# EAGLE design MaPIE LoRa Radio v2.1 (EAGLE 6.1)
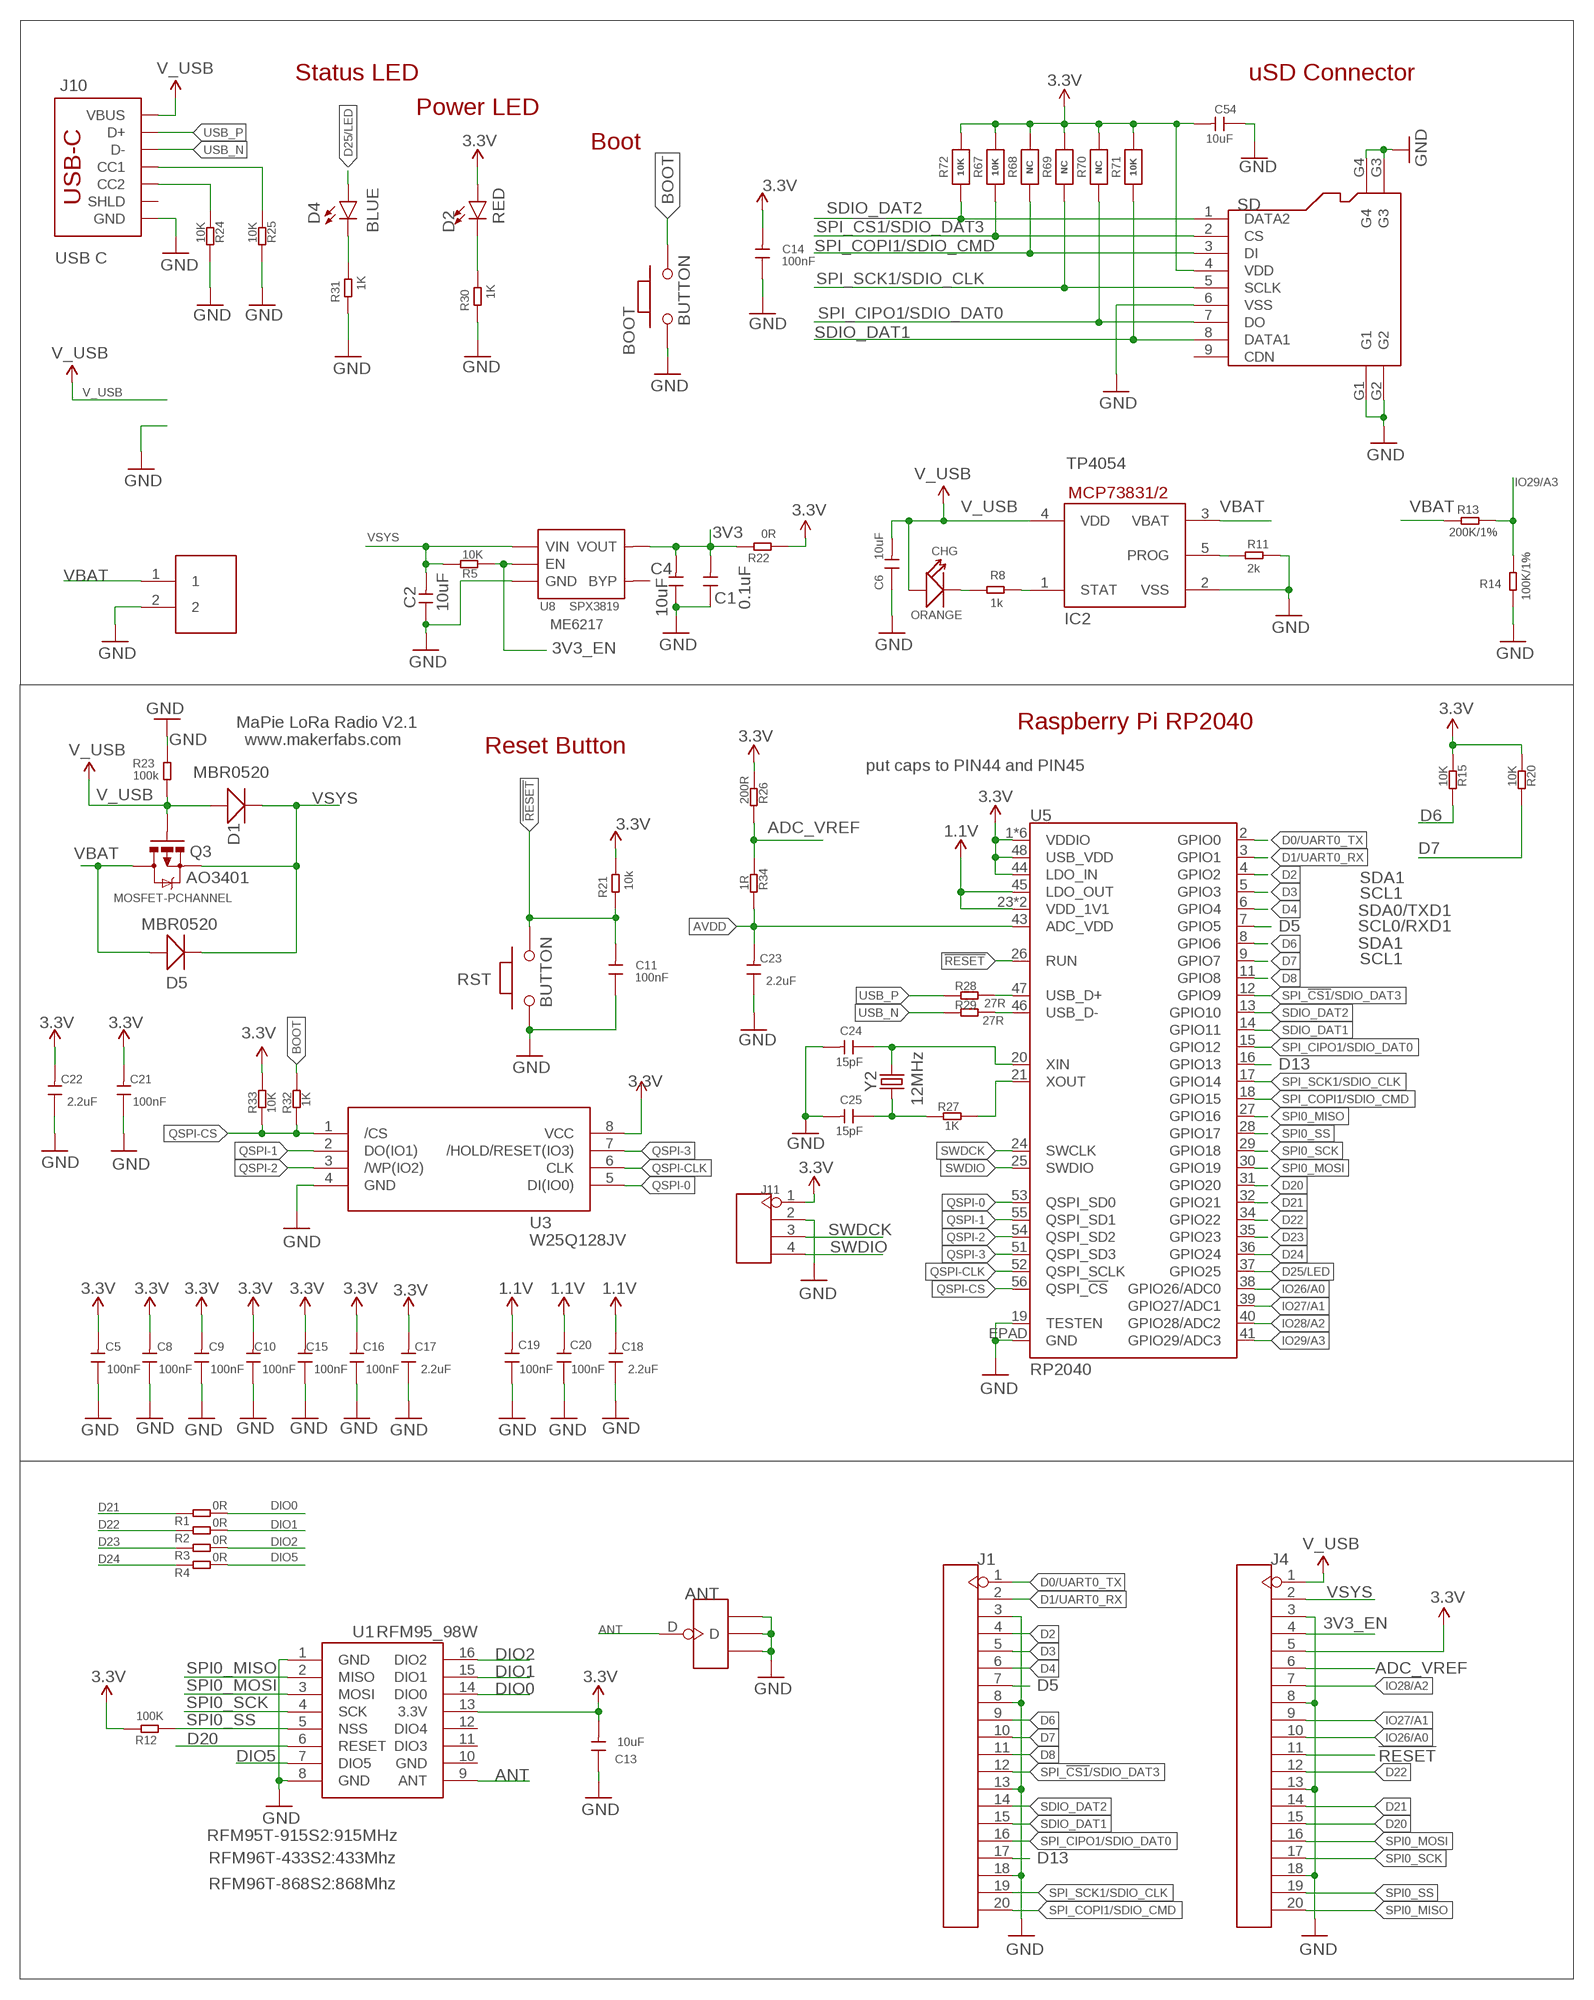
[diagram p0: schematic, sheet 1]

## Parts
ANT  ANTENNA-U-FL  [4P-U-FL]
BOOT  BUTTON  PB157  [157SW]
C1  0.1uF  C-0603  [0603]
C2  10uF  C-0603  [0603]
C4  10uF  C-0603  [0603]
C5  100nF  C-0603  [0603]
C6  10uF  C-0603  [0603]
C8  100nF  C-0603  [0603]
C9  100nF  C-0603  [0603]
C10  100nF  C-0603  [0603]
C11  100nF  C-0603  [0603]
C13  10uF  C-0603  [0603]
C14  100nF  C-0603  [0603]
C15  100nF  C-0603  [0603]
C16  100nF  C-0603  [0603]
C17  2.2uF  C-0603  [0603]
C18  2.2uF  C-0603  [0603]
C19  100nF  C-0603  [0603]
C20  100nF  C-0603  [0603]
C21  100nF  C-0603  [0603]
C22  2.2uF  C-0603  [0603]
C23  2.2uF  C-0603  [0603]
C24  15pF  C-0603  [0603]
C25  15pF  C-0603  [0603]
C54  10uF  DISCRETE_C-0603  [DISCRETE_C0603]
CHG  ORANGE  007-LED0603  [D0603]
D1  MBR0520  D'1206'  [SOD123]
D2  RED  LED-RED0603  [LED-0603]
D4  BLUE  LED-BLUE0603  [LED-0603]
D5  MBR0520  D'1206'  [SOD123]
IC2  MCP73831/OT  [SOT23-5L]
J1  HEADER-20P-2.54  [20P-2.54]
J4  HEADER-20P-2.54  [20P-2.54]
J6  PH2.0-2P-90-DIP  [PH2.0-2P-90-DIP]
J10  USB C  USB_C_4-LAYER-ISOLATED  [USB-C-16P-4LAYER-ISOLATED]
J11  HEADER-4P-60/35MILROUND  [4P-65/35ROUND]
Q3  MOSFET-PCHANNEL  [SOT23-3]
R1  0R  R-0603  [R0603]
R2  0R  R-0603  [R0603]
R3  0R  R-0603  [R0603]
R4  0R  R-0603  [R0603]
R5  10K  R-0603  [R0603]
R8  1k  R-0603  [R0603]
R11  2k  R-0603  [R0603]
R12  100K  R-0603  [R0603]
R13  200K/1%  R-0603  [R0603]
R14  100K/1%  R-0603  [R0603]
R15  10K  R-0603  [R0603]
R20  10K  R-0603  [R0603]
R21  10k  R-0603  [R0603]
R22  0R  R-0603  [R0603]
R23  100k  R-0603  [R0603]
R24  10K  R-0603  [R0603]
R25  10K  R-0603  [R0603]
R26  200R  R-0603  [R0603]
R27  1K  R-0603  [R0603]
R28  27R  R-0603  [R0603]
R29  27R  R-0603  [R0603]
R30  1K  R-0603  [R0603]
R31  1K  R-0603  [R0603]
R32  1K  R-0603  [R0603]
R33  10K  R-0603  [R0603]
R34  1R  R-0603  [R0603]
R67  10K  RESISTOR_0603_NOOUT  [0603-NO]
R68  NC  RESISTOR_0603_NOOUT  [0603-NO]
R69  NC  RESISTOR_0603_NOOUT  [0603-NO]
R70  NC  RESISTOR_0603_NOOUT  [0603-NO]
R71  10K  RESISTOR_0603_NOOUT  [0603-NO]
R72  10K  RESISTOR_0603_NOOUT  [0603-NO]
RST  BUTTON  PB157  [157SW]
SD  HOLDER-MICROSD-9P  [9P-SMD-W/-RING]
U1  RFM95_98W  RFM92_93W  [RFM92_93W]
U3  W25Q128JV  [SOIC-8-208MIL]
U5  RP2040  [QFN-56]
U8  SPX3819  [SOT23-5]
Y2  12MHz  CRYSTAL-12MHZ  [CRYSTAL-SMD-2X2.5MM]

## Nets
1.1V: C18.2 C19.2 C20.2 U5.23(VDD_1V1) U5.45(LDO_OUT) U5.50(VDD_1V1)
3.3V: C5.2 C8.2 C9.2 C10.2 C13.2 C14.2 C15.2 C16.2 C17.2 C21.2 C22.2 C54.2 D2.A J4.5 J11.1 R12.2 R15.2 R20.2 R21.1 R22.1 R26.2 R33.1 R67.2 R68.2 R69.2 R70.2 R71.2 R72.2 SD.4(VDD) U1.13(3.3V) U3.8(VCC) U5.1(VDDIO) U5.10(VDDIO) U5.22(VDDIO) U5.33(VDDIO) U5.42(VDDIO) U5.44(LDO_IN) U5.48(USB_VDD) U5.49(VDDIO)
3V3: C1.2 C4.2 R22.2 U8.5(VOUT)
3V3_EN: J4.4 R5.2 U8.3(EN)
!RESET!: C11.2 J4.11 R21.2 RST.2 U5.26(RUN)
ADC_VREF: J4.6 R26.1 R34.2
ANT: ANT.D U1.9(ANT)
AVDD: C23.2 R34.1 U5.43(ADC_VDD)
BOOT: BOOT.2 R32.1
D0/UART0_TX: J1.1 U5.2(GPIO0)
D1/UART0_RX: J1.2 U5.3(GPIO1)
D2: J1.4 U5.4(GPIO2)
D3: J1.5 U5.5(GPIO3)
D4: J1.6 U5.6(GPIO4)
D5: J1.7 U5.7(GPIO5)
D6: J1.9 R15.1 U5.8(GPIO6)
D7: J1.10 R20.1 U5.9(GPIO7)
D8: J1.11 U5.11(GPIO8)
D13: J1.17 U5.16(GPIO13)
D20: J4.15 U1.6(RESET) U5.31(GPIO20)
D21: J4.14 R1.2 U5.32(GPIO21)
D22: J4.12 R2.2 U5.34(GPIO22)
D23: R3.2 U5.35(GPIO23)
D24: R4.2 U5.36(GPIO24)
D25/LED: D4.A U5.37(GPIO25)
DIO0: R1.1 U1.14(DIO0)
DIO1: R2.1 U1.15(DIO1)
DIO2: R3.1 U1.16(DIO2)
DIO5: R4.1 U1.7(DIO5)
GND: ANT.GND1 ANT.GND2 ANT.GND3 BOOT.1 C1.1 C2.1 C4.1 C5.1 C6.1 C8.1 C9.1 C10.1 C11.1 C13.1 C14.1 C15.1 C16.1 C17.1 C18.1 C19.1 C20.1 C21.1 C22.1 C23.1 C24.2 C25.2 C54.1 IC2.2(VSS) J1.3 J1.8 J1.13 J1.18 J4.3 J4.8 J4.13 J4.18 J6.2 J10.GND J10.GND2(GND) J11.2 R11.2 R14.1 R23.2 R24.1 R25.1 R30.2 R31.2 RST.1 SD.6(VSS) SD.G1 SD.G2 SD.G3 SD.G4 U1.1(GND) U1.8(GND) U3.4(GND) U5.19(TESTEN) U5.EPAD(GND) U8.2(GND)
IO26/A0: J4.10 U5.38(GPIO26/ADC0)
IO27/A1: J4.9 U5.39(GPIO27/ADC1)
IO28/A2: J4.7 U5.40(GPIO28/ADC2)
IO29/A3: R13.1 R14.2 U5.41(GPIO29/ADC3)
N$1: C24.1 U5.20(XIN) Y2.P3
N$2: D4.C R31.1
N$4: R27.1 U5.21(XOUT)
N$6: C25.1 R27.2 Y2.P1
N$7: D2.C R30.1
N$11: J10.A5(CC1) R25.2
N$12: J10.B5(CC2) R24.2
N$25: CHG.- R8.1
N$26: IC2.1(STAT) R8.2
N$31: IC2.5(PROG) R11.1
QSPI-0: U3.5(DI(IO0)) U5.53(QSPI_SD0)
QSPI-1: U3.2(DO(IO1)) U5.55(QSPI_SD1)
QSPI-2: U3.3(/WP(IO2)) U5.54(QSPI_SD2)
QSPI-3: U3.7(/HOLD/RESET(IO3)) U5.51(QSPI_SD3)
QSPI-CLK [Clock]: U3.6(CLK) U5.52(QSPI_SCLK)
QSPI-CS: R32.2 R33.2 U3.1(/CS) U5.56(QSPI_!CS!)
SDIO_DAT1: J1.15 R71.1 SD.8(DATA1) U5.14(GPIO11)
SDIO_DAT2: J1.14 R72.1 SD.1(DATA2) U5.13(GPIO10)
SPI0_MISO: J4.20 U1.2(MISO) U5.27(GPIO16)
SPI0_MOSI: J4.16 U1.3(MOSI) U5.30(GPIO19)
SPI0_SCK: J4.17 U1.4(SCK) U5.29(GPIO18)
SPI0_SS: J4.19 R12.1 U1.5(NSS) U5.28(GPIO17)
SPI_!CS1!/SDIO_DAT3: J1.12 R67.1 SD.2(CS) U5.12(GPIO9)
SPI_CIPO1/SDIO_DAT0: J1.16 R70.1 SD.7(DO) U5.15(GPIO12)
SPI_COPI1/SDIO_CMD: J1.20 R68.1 SD.3(DI) U5.18(GPIO15)
SPI_SCK1/SDIO_CLK: J1.19 R69.1 SD.5(SCLK) U5.17(GPIO14)
SWDCK: J11.3 U5.24(SWCLK)
SWDIO: J11.4 U5.25(SWDIO)
USB_F_N: R29.1 U5.46(USB_D-)
USB_F_P: R28.1 U5.47(USB_D+)
USB_N: J10.A7(D-) J10.B7(D-) R29.2
USB_P: J10.A6(D+) J10.B6(D+) R28.2
V_USB: C6.2 CHG.+ D1.+ IC2.4(VDD) J4.1 J10.VBUS1(VBUS) J10.VBUS2(VBUS) Q3.1(G) R23.1
VBAT: D5.+ IC2.3(VBAT) J6.1 Q3.3(D) R13.2
VSYS: C2.2 D1.- D5.- J4.2 Q3.2(S) R5.1 U8.1(VIN)
Unconnected: J10.SHLD1(SHLD) J10.SHLD2(SHLD) J10.SHLD3(SHLD) J10.SHLD4(SHLD) J10.SHLD5(SHLD) J10.SHLD6(SHLD) J10.SHLD7(SHLD) J10.SHLD8(SHLD) SD.9(CDN) U1.11(DIO3) U1.12(DIO4) U8.4(BYP)

## Notes on the sheet
- Status LED | uSD Connector
- Power LED
- Boot
- TP4054
- ME6217
- Raspberry Pi RP2040
- MaPie LoRa Radio V2.1
- www.makerfabs.com | Reset Button
- put caps to PIN44 and PIN45
- AO3401 | SDA1
- SCL1
- SDA0/TXD1
- SCL0/RXD1
- SDA1
- SCL1
- RFM95T-915S2:915MHz
- RFM96T-433S2:433Mhz
- RFM96T-868S2:868Mhz

## Power pins joined to a net without a drawn wire
GND: U1.10(GND)

## Library data of the parts
ANT = Connector:ANTENNA-U-FL
BOOT RST = MySMD:PB157
C1 C2 C4-C6 C8-C11 C13-C25 = Discrete:C*: Ceramic Capacitors
C54 = A9G:DISCRETE_C*: Ceramic Capacitors
CHG = Discrete:007-LED*
D1 D5 = Discrete:D*
D2 = SparkFun-LED:LED-RED: Red SMD LED Used in manufacturing of most products at SparkFun Packages: 0603 - SMD 0603 package [Product Link] <http://docs.avagotech.com/docs/AV02-0551EN> 0603 SMART - SMD 0603 SMART package ( more efficient and expensive)[Product Link] <http://www.osram-os.com/Graphics/XPic2/00077099_0.pdf> 1206 - SMD1206 package [Product Link] <https://www.sparkfun.com/datasheets/DevTools/LilyPad/Q150OVS4.pdff> SparkFun Products: Pro Mini 328 -5V <https://www.sparkfun.com/products/821> RedBoard <https://www.sparkfun.com/products/12757> IOIO-OTG <https://www.sparkfun.com/products/13613>; PROD_ID: DIO-00819
D4 = SparkFun-LED:LED-BLUE: Blue SMD LED Used in manufacturing of various products at SparkFun Packages: 0603 - SMD 0603 package [Product Link] <http://www.digikey.com/product-detail/en/SMLE12BC7TT86/511-1589-2-ND/1641808> 1206 - SMD1206 package [Product Link] <http://www.digikey.com/product-detail/en/lite-on-inc/LTST-C150TBKT/160-1643-1-ND/573584> SparkFun Products: ESP8266 Thing-Dev Board <https://www.sparkfun.com/products/13711> RedBoard <https://www.sparkfun.com/products/12757>; PROD_ID: DIO-08575
IC2 = adafruit:MCP73831: MCP73831/2 Miniature Single-Cell, Fully Integrated Li-Ion, Li-Polymer Charge Management Controllers. Nice and small simple lipoly charge controller, with adjustable current and status output (LED) http://www.ladyada.net/library/pcb/eaglelibrary.html
J1 J4 = Connector:HEADER-20P
J6 = Connector:PH2.0-2P-90-DIP
J10 = SparkFun-Connectors:USB_C: USB Type C 16Pin Connector Super Speed pins not available on the 16-pin purely SMD connector so this part is best for USB 2.0 implementations. D1 and D2 are tied together enabling D+/- no matter which way the cable is plugged into the connector. The two channel configuration pins (CC1/2) are exposed. These are normally connected to ground via 5.1k resistors but can be reconfigured for high current/high power applications. **4-LAYER BOARD WARNING!!** If designing 4-layer board, make sure to select the variant _4-LAYER-ISOLATED. The linked footprint (USB-C-16-4LAYER-ISOLATED) includes some very necessary cutout polygons in the inner layers (2 and 15). This prevents the PTH mounting shield legs on the USB connector from electrically connecting any other polygons on the inner layers (usually VCC and GND).; PROD_ID: CONN-14122; VALUE: USB Female Type C Connector
J11 = Connector:HEADER-4P
Q3 = User-Submitted:MOSFET-PCHANNEL: Generic PMOSFET IRLML2244 - TRANS-11153 (SOT-23 -20V -4.3A) (1.Gate 2.Source 3.Drain) FQP27P06 - COM-10349 <http://www.sparkfun.com/products/10349> (TO-220 -60V -27A) (1.Gate 2.Source 3.Drain); PROD_ID: TRANS-08285
R1-R5 R8 R11-R15 R20-R34 = Discrete:R*
R67-R72 = microbuilder:RESISTOR: Resistors For new designs, use the packages preceded by an '_' character since they are more reliable: The following footprints should be used on most boards: _0402 - Standard footprint for regular board layouts _0603 - Standard footprint for regular board layouts _0805 - Standard footprint for regular board layouts _1206 - Standard footprint for regular board layouts For extremely tight-pitch boards where space is at a premium, the following 'micro-pitch' footprints can be used (smaller pads, no silkscreen outline, etc.): _0402MP - Micro-pitch footprint for very dense/compact boards _0603MP - Micro-pitch footprint for very dense/compact boards _0805MP - Micro-pitch footprint for very dense/compact boards _1206MP - Micro-pitch footprint for very dense/compact boards
SD = Connector:HOLDER-MICROSD-9P
U1 = dragino:RFM92_93W
U3 = self:W25Q128JV
U5 = RP2040:RP2040: Raspberry Pi RP2040 MCU 56-pin 32-bit Microcontroller with 264kB of SRAM and external flash support up to 16MB Getting Started with the RP2040 <https://pico.raspberrypi.org/getting-started/> Dual-core ARM Cortex M0+ processor, flexible clock running up to 133 MHz 264kB of SRAM, and QSPI control of common flash memory USB 1.1 Host and Device support Low-power sleep and dormant modes Drag & drop programming using mass storage over USB 26 multi-function GPIO pins 2×SPI, 2×I2C, 2×UART, 3×12-bit ADC, 16×controllable PWM channels Accurate clock and timer on-chip Temperature sensor Accelerated floating point libraries on-chip 8×Programmable IO (PIO) state machines for custom peripheral support; PROD_ID: IC-15502
U8 = IC:SPX3819
Y2 = SparkFun-Clocks:CRYSTAL-12MHZ: 12.0MHz Crystal Frequency: 12.0MHz Frequency Tolerance: ±20ppm Load Capacitance: 18pF SparkFun Products: SparkFun Logomatic <https://www.sparkfun.com/products/12772> Pocket AVR Programmer <https://www.sparkfun.com/products/9825>; PROD_ID: XTAL-15540

## Net classes
0 default: width 0.203 mm, drill 0.305 mm, clearance 0.152 mm
2 Clock: width 0.089 mm, clearance 0.178 mm

## Board
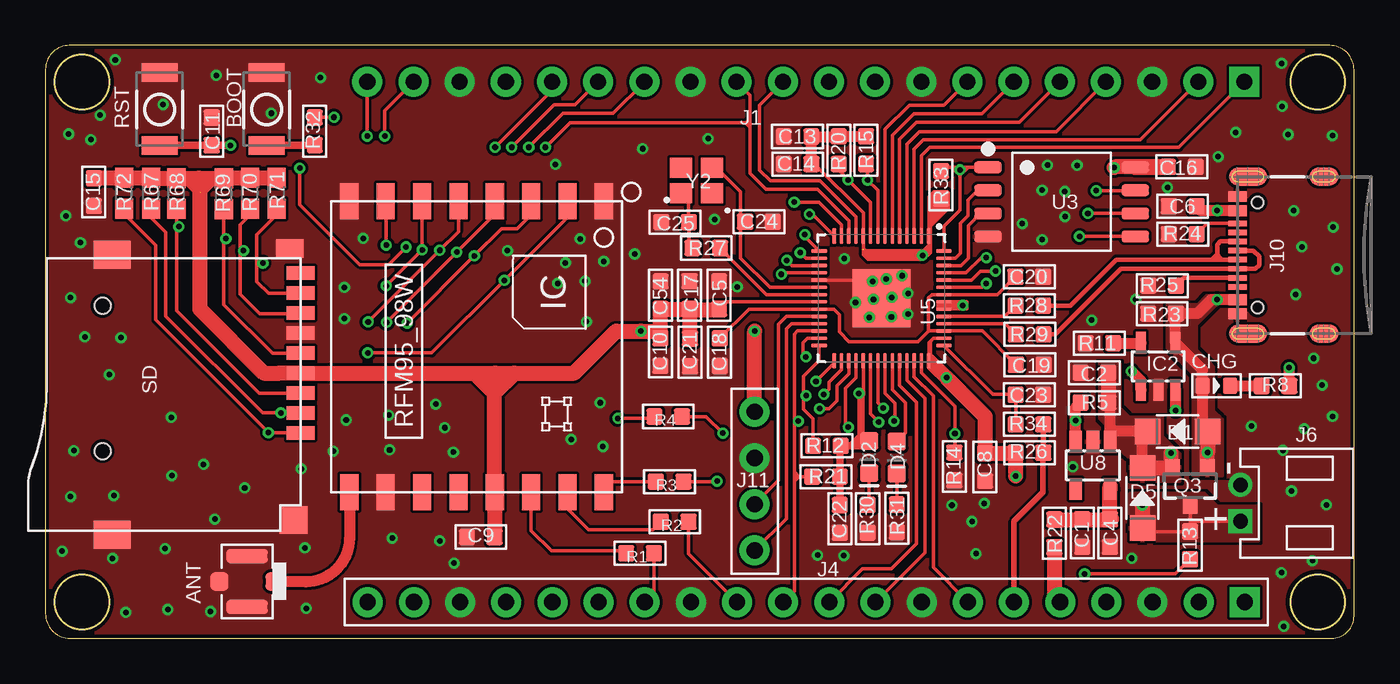
[diagram p1: board, top side]
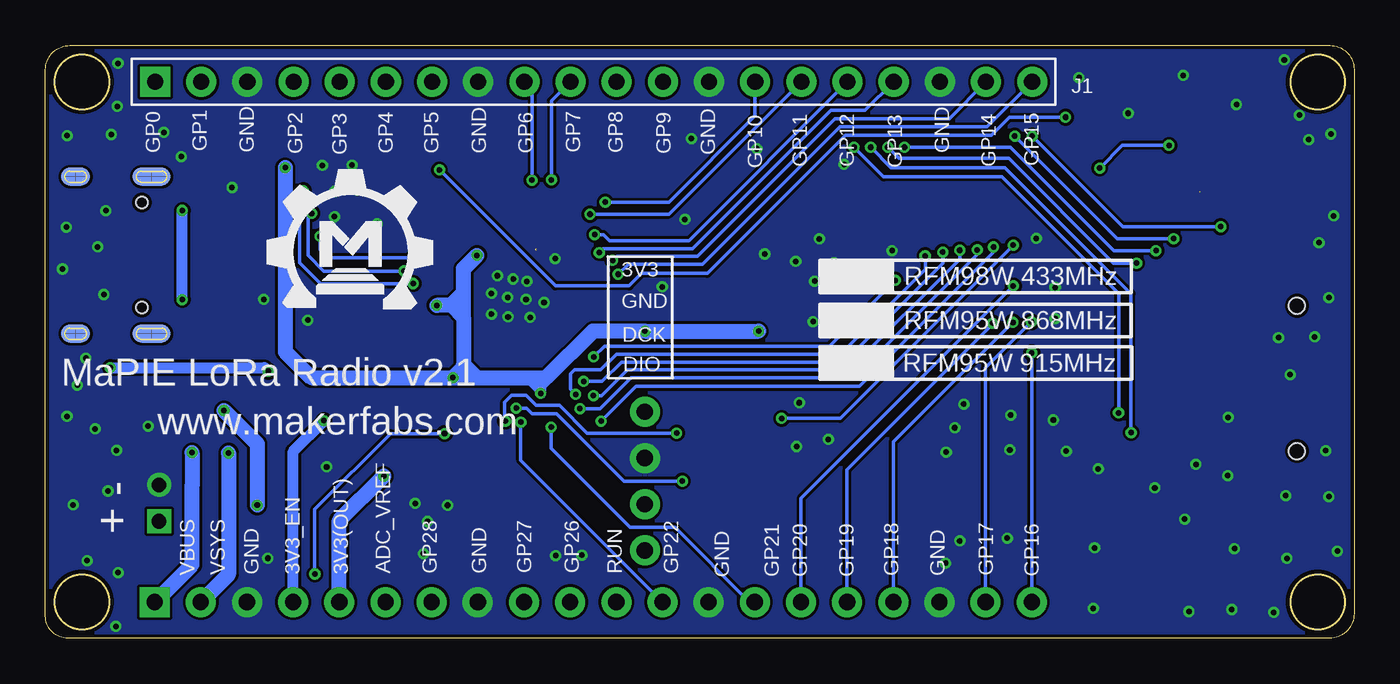
[diagram p2: board, bottom side, seen from below]

Size 72 x 32.6 mm. Coordinates in mm from the lower left corner, seen from the top.
Outline: 1.35,0 70.78,0 arc90 72,1.22 72,31.26 arc90 70.66,32.6 1.32,32.6 arc90 0,31.28 0,1.35 arc90 1.35,0
Outline: circle at 2,2 radius 1.5
Outline: circle at 2,30.6 radius 1.5
Outline: circle at 70,30.6 radius 1.5
Outline: circle at 70,2 radius 1.5
Copper layers (1*16): Top 0.035mm / dielectric 1.5mm / Bottom 0.035mm
Design rules: minimum track width 8mil, minimum drill 8mil, track to track 6mil, track to pad 6mil, pad to pad 6mil, via to via 6mil, smd to smd 8mil, copper to edge 8mil, drill to drill 8mil, minimum pad ring 10mil, minimum via ring 6mil, stop-mask expansion 4mil, vias tented up to drill 100mil, thermal gap 0mil

### Footprints (pad centres in the part's own frame; a part is rotated, then mirrored left to right if it is on the bottom)
4P-U-FL = smd 1.016 x 1.016: D -1.524,0; GND3 1.524,0 | smd 2.286 x 0.762: GND1 0,1.397; GND2 0,-1.397
157SW = smd 1.016 x 1.981: 1 0,0; 2 4,0
0603 = smd 0.889 x 0.889: 1 -0.762,0; 2 0.762,0
DISCRETE_C0603 = smd 0.889 x 0.889: 1 -0.762,0; 2 0.762,0
D0603 = smd 0.762 x 0.889: + -0.762,0; - 0.762,0
SOD123 = smd 1.397 x 1.397: + -1.651,0; - 1.651,0
LED-0603 = smd 1 x 1: A -0.877,0; C 0.877,0
SOT23-5L = smd 0.55 x 1.2: 1 -0.95,-1.3; 2 0,-1.3; 3 0.95,-1.3; 4 0.95,1.3; 5 -0.95,1.3
20P-2.54 = drill 0.889 pad 1.651 square: 1 -25.4,0 | drill 0.889 pad 1.651: 2 -22.86,0; 3 -20.32,0; 4 -17.78,0; 5 -15.24,0; 6 -12.7,0; 7 -10.16,0; 8 -7.62,0; 9 -5.08,0; 10 -2.54,0; 11 0,0; 12 2.54,0; 13 5.08,0; 14 7.62,0; 15 10.16,0; 16 12.7,0; 17 15.24,0; 18 17.78,0; 19 20.32,0; 20 22.86,0
PH2.0-2P-90-DIP = drill 0.8 square: 1 0,1 | drill 0.8: 2 0,-1
USB-C-16P-4LAYER-ISOLATED = smd 0.3 x 1: A5 -1.25,-0.34; A6 -0.25,-0.34; A7 0.25,-0.34; A8 1.25,-0.34; B5 1.75,-0.34; B6 0.75,-0.34; B7 -0.75,-0.34; B8 -1.75,-0.34 | smd 0.6 x 1: GND -3.225,-0.34; GND2 3.225,-0.34; VBUS1 -2.45,-0.34; VBUS2 2.45,-0.34 | smd 1 x 2.1: SHLD1 -4.32,-0.915; SHLD2 4.32,-0.915 | smd 1 x 2.1 bottom: SHLD3 -4.32,-0.915; SHLD4 4.32,-0.915 | smd 1 x 1.6: SHLD5 -4.32,-5.095; SHLD8 4.32,-5.095 | smd 1 x 1.6 bottom: SHLD6 -4.32,-5.095; SHLD7 4.32,-5.095 | hole 0.65: -2.89,-1.445; 2.89,-1.445
4P-65/35ROUND = drill 0.889 pad 1.651: 1 0,3.81; 2 0,1.27; 3 0,-1.27; 4 0,-3.81
SOT23-3 = smd 0.8 x 0.9: 1 -0.95,-1; 2 0.95,-1; 3 0,1.1
R0603 = smd 0.889 x 0.889: 1 -0.762,0; 2 0.762,0
0603-NO = smd 1.1 x 1: 1 -0.85,0; 2 0.85,0
9P-SMD-W/-RING = smd 1.524 x 0.762: 1 0,4.4; 2 0,3.3; 3 0,2.2; 4 0,1.1; 5 0,0; 6 0,-1.1; 7 0,-2.2; 8 0,-3.3; 9 0,-4.4 | smd 1.524 x 1.016: G1 0.6,-5.746 | smd 2.032 x 1.524: G2 10.373,-5.4; G3 10.373,10 | smd 1.524 x 1.524: G4 0.392,9.181 | hole 0.889: 10.9,-2.6; 10.9,5.4
RFM92_93W = smd 2 x 1: 1 -8,7; 2 -8,5; 3 -8,3; 4 -8,1; 5 -8,-1; 6 -8,-3; 7 -8,-5; 8 -8,-7; 9 8,-7; 10 8,-5; 11 8,-3; 12 8,-1; 13 8,1; 14 8,3; 15 8,5; 16 8,7
SOIC-8-208MIL = smd 1.5 x 0.635: 1 -4.05,1.905; 2 -4.05,0.635; 3 -4.05,-0.635; 4 -4.05,-1.905; 5 4.05,-1.905; 6 4.05,-0.635; 7 4.05,0.635; 8 4.05,1.905
QFN-56 = smd 0.875 x 0.2: 1 -3.437,2.6; 2 -3.437,2.2; 3 -3.437,1.8; 4 -3.437,1.4; 5 -3.437,1; 6 -3.437,0.6; 7 -3.437,0.2; 8 -3.437,-0.2; 9 -3.437,-0.6; 10 -3.437,-1; 11 -3.437,-1.4; 12 -3.437,-1.8; 13 -3.437,-2.2; 14 -3.437,-2.6; 29 3.437,-2.6; 30 3.437,-2.2; 31 3.437,-1.8; 32 3.437,-1.4; 33 3.437,-1; 34 3.437,-0.6; 35 3.437,-0.2; 36 3.437,0.2; 37 3.437,0.6; 38 3.437,1; 39 3.437,1.4; 40 3.437,1.8; 41 3.437,2.2; 42 3.437,2.6 | smd 0.2 x 0.875: 15 -2.6,-3.437; 16 -2.2,-3.437; 17 -1.8,-3.437; 18 -1.4,-3.437; 19 -1,-3.437; 20 -0.6,-3.437; 21 -0.2,-3.437; 22 0.2,-3.437; 23 0.6,-3.437; 24 1,-3.437; 25 1.4,-3.437; 26 1.8,-3.437; 27 2.2,-3.437; 28 2.6,-3.437; 43 2.6,3.437; 44 2.2,3.437; 45 1.8,3.437; 46 1.4,3.437; 47 1,3.437; 48 0.6,3.437; 49 0.2,3.437; 50 -0.2,3.437; 51 -0.6,3.437; 52 -1,3.437; 53 -1.4,3.437; 54 -1.8,3.437; 55 -2.2,3.437; 56 -2.6,3.437 | smd 3.2 x 3.2: EPAD 0,0
SOT23-5 = smd 0.69 x 1.2: 1 -0.95,-1.3; 2 0,-1.3; 3 0.95,-1.3; 4 0.95,1.3; 5 -0.95,1.3
CRYSTAL-SMD-2X2.5MM = smd 1.2 x 1.1: P1 0.846,0.69; P2 -0.854,0.69; P3 -0.854,-0.71; P4 0.846,-0.71

### Placement (x,y rotation side)
ANT  11.09,3.12 180 top
BOOT  12.18,31.11 270 top
C1  57.04,5.78 90 top
C2  57.71,14.6 0 top
C4  58.56,5.78 90 top
C5  37.07,18.87 270 top
C6  62.57,23.75 0 top
C8  51.7,9.42 90 top
C9  23.95,5.56 0 top
C10  33.84,15.74 90 top
C11  9.15,27.88 270 top
C13  41.38,27.59 0 top
C14  41.38,26.08 0 top
C15  2.67,24.54 90 top
C16  62.52,25.92 180 top
C17  35.44,18.87 270 top
C18  37.1,15.73 90 top
C19  54.16,15.04 180 top
C20  54.13,19.88 180 top
C21  35.47,15.72 90 top
C22  43.7,6.56 90 top
C23  54.14,13.39 180 top
C24  39.25,22.9 0 top
C25  34.64,22.88 180 top
C54  33.85,18.86 270 top
CHG  64.42,13.88 0 top
D1  62.29,11.37 180 top
D2  45.32,9.97 270 top
D4  46.84,9.94 270 top
D5  60.35,7.71 90 top
IC2  61.22,14.95 0 top
J1  40.57,30.6 0 bottom
J4  40.59,1.99 180 top
J6  65.75,7.43 180 top
J10  65.25,21.07 90 top
J11  39.02,8.64 0 top
Q3  62.98,8.39 180 top
R1  32.72,4.67 0 top
R2  34.62,6.4 0 top
R3  34.34,8.61 0 top
R4  34.26,12.19 0 top
R5  57.72,12.96 180 top
R8  67.67,13.87 0 top
R11  57.99,16.23 180 top
R12  43,10.58 0 top
R13  62.98,5.1 90 top
R14  50.01,9.44 90 top
R15  45.15,26.84 90 top
R20  43.65,26.84 90 top
R21  42.95,8.89 180 top
R22  55.51,5.76 90 top
R23  61.43,17.85 180 top
R24  62.57,22.22 0 top
R25  61.45,19.39 0 top
R26  54.15,10.2 180 top
R27  36.35,21.46 180 top
R28  54.14,18.29 0 top
R29  54.16,16.71 0 top
R30  45.24,6.57 270 top
R31  46.84,6.59 270 top
R32  14.82,27.88 90 top
R33  49.28,24.93 90 top
R34  54.14,11.76 0 top
R67  5.82,24.48 90 top
R68  7.21,24.46 90 top
R69  9.82,24.45 90 top
R70  11.27,24.46 90 top
R71  12.72,24.46 90 top
R72  4.34,24.48 90 top
RST  6.28,31.11 270 top
SD  14.04,15.68 180 top
U1  23.72,16.03 270 top
U3  55.91,24 0 top
U5  46,18.7 270 top
U8  57.63,9.5 180 top
U$1  [MAKERFABS_0.3]  59.34,18.16 0 bottom
Y2  35.82,25.16 180 top

### Tracks (layer width: path | path; a pad name or v marks a point on that pad's centre or on a via)
1.1V
  Top 0.203: C18.2 38.7,18.1 U5.23 43.37,18.1 43.69,17.78 43.69,16.84 44.22,16.31 48.01,16.31 48.59,16.89 | 48.59,16.89 48.59,18.72 48.77,18.9 U5.50 52.39,18.9 C20.2 | 48.59,16.89 48.59,16.9 U5.45 51.54,16.9 C19.2
3.3V  (via drill 0.3)  (2 unrouted)
  Top 0.203: U5.48 U5.49 49.63,18.3 | 51.71,10.2 C8.2 | U5.1 48.6,23.49 R33.1 | C14.2 42.33,26.08 45,23.41 U5.10 45,21.35 45.29,21.06 v48.26,21.06 | 45,14.16 U5.33 45,13.39 44.92,13.46 v44.76,13.46 | U5.22 37.46,18.5 C5.2 | v50.47,18.3 49.63,18.3 | v48.26,21.06 48.28,21.06 48.6,21.37 U5.1 | 49.28,18.49 50.7,18.49 50.7,18.31 | 50.7,18.31 50.7,18.11 49.1,18.11 49.1,18.49 49.28,18.49 | 49.28,18.49 49.28,18.19 49.63,18.19 | 49.63,18.3 49.64,18.31 50.7,18.31 | 48.7,15.26 U5.42 | U5.44 48.86,16.5 48.6,16.24 U5.42 | v49.58,14.33 48.65,15.26 U5.42 | 49.94,13.97 49.51,13.97 48.62,14.86 48.62,16.23 48.69,16.31 | 48.87,16.48 48.69,16.31 | 48.69,16.31 48.69,15.62 49.86,14.45 49.86,14.38 49.76,14.38 48.72,15.42 48.72,14.96 49.25,14.43 | U5.1 48.6,21.39 v48.26,21.06 | 48.62,22.78 48.62,21.61 48.31,21.31 45.14,21.31 45.01,21.44 45.01,21.41 | 48.62,22.78 48.62,24.28 48.9,24.56 49.63,24.56 49.68,24.51 49.68,23.65 48.69,22.66 48.69,21.21 48.31,20.83 45.26,20.83 45.01,21.08 45.01,21.41 | 45.01,21.41 45.21,21.21 48.28,21.21 48.31,21.18 48.31,20.98 48.28,20.95 45.36,20.95 45.19,21.13 | 48.62,22.78 49.55,23.72 49.35,23.72 48.72,23.09 48.72,23.29 49.17,23.75 49.02,23.75 48.72,23.44 48.72,24.21 48.82,24.31 48.82,23.8 48.77,23.75
  Top 0.406: C22.2 R21.1 arc-90 R21.1 43.71,10.53 arc-90 R12.2 44.35,10.58 | 44.35,10.58 45.05,10.58 arc90 D2.A | v44.76,13.46 44.88,13.34 44.88,11.11 44.35,10.58
  Top 0.61: C14.2 C13.2 R20.2 R15.2 | 8.51,24.46 8.51,24.54 9.25,25.27 | 8.48,24.33 8.48,24.56 7.77,25.27 7.77,25.3
  Top 0.813: C15.2 2.7,25.33 R72.2 R67.2 5.84,25.31 R68.2 8.46,25.3 | 8.46,25.3 R69.2 9.82,25.31 R70.2 R71.2 | 8.46,25.3 8.51,25.25 8.51,24.46 8.51,18.09 12.01,14.58 12.87,14.58 SD.4 24.77,14.58 | 24.77,14.58 29.09,14.58 31.39,16.89 v32.77,16.89 33.68,16.89 33.84,17.04 | 24.72,14.54 U1.13 24.72,5.57 C9.2 | 24.72,14.54 24.77,14.58 | C10.2 33.84,17.04 | 33.84,17.04 33.84,18.09 C54.2 C17.2 35.47,18.08 | C21.2 35.47,18.08 | 35.47,18.08 37.04,18.08 C5.2 | J11.1 39.02,16.88 v39.01,16.89 | v58.8,25.88 58.84,25.92 C16.2 61.73,25.9 U3.8 | 51.71,10.2 51.71,12.19 49.94,13.97 v49.58,14.33 | C8.2 53.37,10.18 R26.2 v53.39,8.91 | R22.1 55.51,2.3 J4.5 | 23.7,14.5 23.7,14.48 | 23.7,14.48 24.71,13.46 24.71,13.49 25.81,14.58 | 24.72,14.54 23.76,14.54 23.7,14.48
  Bottom 0.61: 44.45,14.33 44.76,14.02 44.76,13.89 | v44.76,13.46 44.76,13.66 | 44.76,13.66 44.76,13.89 | 44.76,13.89 44.04,14.61 44.22,14.61 44.53,14.3 45.39,14.3 | 45.64,14.3 45.39,14.3 | 45.39,14.3 44.76,13.66
  Bottom 0.813: v32.77,16.89 v39.01,16.89 41.88,16.89 44.45,14.33 48.28,14.33 | v58.8,25.88 58.8,15.75 57.38,14.33 v49.58,14.33 | v49.58,14.33 49.17,14.33 | 49.17,14.33 48.28,14.33 | 49,14.5 49.17,14.33 | 49,17.66 49.64,18.3 v50.47,18.3 | J4.5 55.83,6.47 v53.39,8.91 | 49,17.66 49,15.04 | 49,15.04 49,14.91 v49.58,14.33 | 48.28,14.33 49,15.04 | 49,17.66 49,19 | 49,19 49.71,18.29 | 49,19 49,20.32 v48.26,21.06
3V3
  Top 0.203: 57.03,6.53 C1.2
  Top 0.813: R22.2 57,6.53 | 57,6.53 58.55,6.53 58.55,6.55 58.56,6.55 | 58.56,6.55 58.57,6.55 | 58.65,6.55 58.57,6.55 | 58.57,6.55 U8.5 | U8.5 58.57,8.36 | U8.5 | 58.56,6.55 C4.2 | C1.2 57,6.54 57,6.53
3V3_EN  (via drill 0.3)
  Top 0.61: U8.3 v56.68,11.96 56.68,12.68 R5.2
  Bottom 0.61: J4.4 58.37,10.27 v56.68,11.96
!RESET!  (via drill 0.3)
  Top 0.203: U5.26 41.38,16.9 41.2,16.71 41.2,11.94 | 41.2,8.91 41.2,8.64 | 41.2,8.64 41.2,2.59 J4.11 | R21.2 41.23,8.89 41.2,8.91 | 41.2,8.91 41.2,9.14 | 41.2,9.14 41.2,11.94 | v41.43,11.94 41.2,11.94 | v13.99,25.86 13.99,23.85 17.3,20.55 18.87,20.55 v19.84,21.51 | 41.2,9.14 41.45,8.89 41.2,8.64
  Top 0.406: RST.2 C11.2 10.17,27.11 v10.19,27.1
  Bottom 0.203: v41.43,11.94 39.5,13.87 27.2,13.87 19.84,21.23 v19.84,21.51 | v10.19,27.1 12.75,27.1 v13.99,25.86
ADC_VREF
  Top 0.305: J4.6 53.29,6.43 54.89,8.03 54.89,10.18 R26.1 R34.2
ANT
  Top 0.61: U1.9 16.72,5.5 arc-90 14.33,3.1 12.63,3.1 arc-90 ANT.D
AVDD
  Top 0.203: R34.1 C23.2 53.35,13.41 52.12,13.41 U5.43
BOOT
  Top 0.406: BOOT.2 14.81,27.11 R32.1
D0/UART0_TX
  Top 0.203: U5.2 48.2,26.53 48.67,27 62.37,27 J1.1
D1/UART0_RX
  Top 0.203: U5.3 47.8,26.89 48.31,27.41 60.24,27.41 J1.2
D2
  Top 0.203: U5.4 47.4,27.18 48.08,27.86 55.61,27.86 J1.4
D3
  Top 0.203: U5.5 47,27.44 47.93,28.37 53.58,28.37 J1.5
D4
  Top 0.203: J1.6 51.52,28.85 47.78,28.85 46.6,27.67 U5.6
D5
  Top 0.203: U5.7 46.2,27.98 47.52,29.31 49.44,29.31 J1.7
D6  (via drill 0.3)
  Top 0.203: U5.8 45.8,24.64 v45.24,25.2 45.24,26 R15.1
  Bottom 0.203: J1.9 45.24,30.19 v45.24,25.2
D7  (via drill 0.3)
  Top 0.203: U5.9 45.4,23.98 v44.16,25.21 43.65,25.72 R20.1
  Bottom 0.203: J1.10 44.16,29.55 v44.16,25.21
D8
  Top 0.203: U5.11 44.6,23.17 42.62,25.15 39.88,25.15 39.29,25.73 39.29,29.32 J1.11
D13  (via drill 0.3)
  Top 0.203: U5.16 41.84,20.9 v41.53,21.21
  Bottom 0.203: v41.53,21.21 41.33,21.41 36.4,21.41 28.78,29.03 26.9,29.03 J1.17
D20  (via drill 0.3)
  Top 0.203: U1.6 v20.72,21.36 v20.73,21.36 v18.75,19.38 | U5.31 44.2,14.55 43.54,13.89 43.54,13.06 43.1,12.62 v42.6,12.62
  Bottom 0.203: v42.6,12.62 41.48,12.62 39.78,14.33 27.51,14.33 20.73,21.11 v20.73,21.36 | v18.75,19.38 30.43,7.69 J4.15
D21  (via drill 0.3)
  Top 0.203: U5.32 44.6,14.32 44.02,13.74 44.02,11.76 v44.17,11.61 | J4.14 33.26,1.99 33.48,2.2 R1.2
  Bottom 0.203: v44.17,11.61 44.17,10.44 39.83,6.1 37.37,6.1 33.26,1.99 J4.14
D22  (via drill 0.3)
  Top 0.203: U5.34 45.4,12.34 v45.85,11.89 | J4.12 35.38,4.66 R2.2
  Bottom 0.203: J4.12 45.85,9.78 v45.85,11.89
D23  (via drill 0.3)
  Top 0.203: U5.35 45.8,12.95 v46.1,12.65 | v36.96,8.64 36.93,8.61 R3.2
  Bottom 0.203: v36.96,8.64 40.16,8.64 43.87,12.34 45.24,12.34 45.54,12.65 v46.1,12.65
D24  (via drill 0.3)
  Top 0.203: U5.36 46.2,13.47 46.74,12.93 46.74,11.99 v46.69,11.94 | v37.27,11.28 36.35,12.19 R4.2
  Bottom 0.203: v46.69,11.94 46.74,11.99 46.74,12.98 46.35,13.36 45.57,13.36 45.01,12.8 43.71,12.8 42.19,11.28 v37.27,11.28
D25/LED
  Top 0.203: U5.37 46.6,13.68 47.32,12.95 47.32,11.29 D4.A
DIO0
  Top 0.203: U1.14 26.72,5.92 27.84,4.8 31.9,4.8 31.9,4.72 31.95,4.72 R1.1
DIO1
  Top 0.203: U1.15 28.72,7.12 29.87,5.97 33.43,5.97 R2.1
DIO2
  Top 0.203: U1.16 30.75,8 | U1.16 30.78,7.98 | R3.1 31.06,8.61 arc90 30.89,8.43 30.89,8.19 arc-90 U1.16
DIO5  (via drill 0.3)
  Top 0.203: U1.7 18.75,24.01 v18.75,21.61 | v31.5,12.09 33.4,12.09 arc90 R4.1
  Bottom 0.203: v18.75,21.61 28.27,12.09 v31.5,12.09
GND  (via drill 0.3)
  Top 0.203: U5.19 45,19.7 U5.EPAD
  other vias: 50.97,6.42 10.96,8.27 6.58,4.92 6.73,1.58 9.08,1.47 28.93,10.94 3.76,7.84 1.56,10.31 2.17,16.57 1.93,21.75 28.19,19.52 21.97,11.57 29.42,21.97 25.42,21.31 3.84,31.81 3.52,14.5 8.71,9.56 0.92,4.79 6.92,12.14 6.95,8.94 55.14,26.02 1.38,7.79 3.69,4.39 4.42,1.42 29.68,19.64 30.68,10.54 69.78,15.4 70.47,7.33 68.13,0.65 54.84,21.92 69.27,11.51 70.82,12.2 69.71,4.27 68.05,29.25 68.37,27.7 70.8,27.64 68,3.6 68.56,8.09 68.79,18.9 65.49,27.82 56.09,24.57 71.06,20.3 56.09,23.18 53.74,22.8 51.2,4.65 56.76,26.01 68.68,23.52 59.77,4.4 68.01,31.61 66.35,11.66 54.84,24.64 1.12,23.23 16.54,12 4.15,16.53 30.72,20.72 3.01,28.77 29.76,17.41 2.5,27.42 1.39,18.73 1.27,27.73 69.12,21.53 70.84,22.61 16.45,19.3 17.49,21.99 16.45,17.57 15.84,10.28 18.89,12.26 18.94,10.36 22.44,10.23 21.48,12.87 30.52,12.95 28.61,20.65 28.06,26.06 32.86,26.92 36.46,27.48 32.42,21.13 38.06,19.33 43.96,20.87 44.57,18.46 45.33,17.65 46.55,17.67 47.46,17.83 47.46,18.97 47.13,19.93 45.51,19.63 46.27,19.76 46.57,18.74 45.56,18.64 56.53,9.42 59.98,18.64 57.57,17.5 64.53,26.49 61.74,24.79 68.09,10.33 70.24,13.92 42.48,4.57 43.93,4.54 51.65,7.41 49.87,7.31 21.69,5.35 19.08,5.5 22.48,4.13 9.32,6.54 14.35,1.64 14.27,4.97 14.07,9.31 6.48,29.35 9.4,30.95 12.42,28.87 15.14,30.83 36.82,23.03
  pour Top (rank 6): -8.51,37.36 75.44,37.36 75.44,-3.17 -8.52,-3.17 -8.52,37.36
  pour Bottom (rank 6): -2.54,35.56 76.2,35.56 76.2,-2.54 -2.54,-2.54
IO26/A0
  Top 0.203: J4.10 44.95,3.81 46.56,3.81 47.93,5.18 47.93,12.98 47,13.91 U5.38
IO27/A1
  Top 0.203: J4.9 48.39,4.7 48.39,13.18 47.4,14.17 U5.39
IO28/A2
  Top 0.203: J4.7 48.84,3.89 48.84,13.34 47.8,14.38 U5.40
IO29/A3  (via drill 0.3)
  Top 0.203: v57.17,3.53 62.17,3.53 R13.1 | R14.2 50.04,10.23 v50.04,11.25 50.04,12.75 48.2,14.59 U5.41
  Bottom 0.203: v57.17,3.53 57.17,7.09 53.01,11.25 v50.04,11.25
N$1
  Top 0.203: U5.20 39.86,19.3 38.25,20.9 38.25,22.9 C24.1 38.49,23.22 38.25,23.22 38.25,24.56 37.24,25.58 36.96,25.58 Y2.P3
N$2
  Top 0.203: D4.C R31.1
N$4
  Top 0.203: U5.21 39.68,18.9 R27.1
N$6
  Top 0.203: C25.1 35.43,22.89 | 35.43,24.28 35.38,24.28 Y2.P1 35.38,24.34 35.38,22.89 C25.1 | 35.38,23.06 35.59,23.06 35.59,22.89 C25.1 | R27.2 35.41,21.46 35.41,21.77 35.4,21.77 C25.1
N$7
  Top 0.203: D2.C 45.32,7.41 R30.1
N$11
  Top 0.254: J10.A5 62.63,19.82 R25.2
N$12
  Top 0.203: J10.B5 63.93,22.82 R24.2
N$25
  Top 0.61: CHG.- 66.9,13.88 R8.1
N$26  (via drill 0.3)
  Top 0.61: IC2.1 60.27,14.15 v59.74,14.68 | R8.2 v68.44,14.88 v68.43,14.88
  Bottom 0.61: v68.43,14.88 59.94,14.88 v59.74,14.68
N$31
  Top 0.61: R11.1 60.25,16.23 IC2.5
QSPI-0  (via drill 0.3)
  Top 0.203: U3.5 v56.9,22.1 | U5.53 50.65,20.1 51.49,20.93 v51.77,20.93
  Bottom 0.203: v51.77,20.93 56.46,20.93 56.9,21.36 v56.9,22.1
QSPI-1
  Top 0.203: U5.55 50.05,20.9 50.34,21.18 50.34,22.84 50.75,23.24 50.75,24.08 51.31,24.64 U3.2
QSPI-2
  Top 0.203: U3.3 51.45,23.36 50.77,22.68 50.77,20.9 50.37,20.5 U5.54
QSPI-3  (via drill 0.3)
  Top 0.203: U3.7 59.95,24.61 v57.81,24.61 | U5.51 51.55,19.3 v51.77,19.51
  Bottom 0.203: v51.77,19.51 56.87,19.51 58.01,20.65 58.01,24.41 v57.81,24.61
QSPI-CLK  (via drill 0.3)
  Top 0.203: U5.52 50.94,19.7 51.44,20.19 v52.27,20.19 | U3.6 v57.35,23.37
  Bottom 0.203: v52.27,20.19 56.69,20.19 57.56,21.06 57.56,23.16 v57.35,23.37
QSPI-CS  (via drill 0.3)
  Top 0.203: 50.32,25.45 50.32,23.55 49.43,22.66 U5.56 | 50.32,25.45 v50.32,25.76 50.32,25.85 50.37,25.9 | U3.1 50.37,25.9 | 50.37,25.9 49.49,25.9 R33.2 | R32.2 v15.88,28.65 | 50.32,25.45 49.89,25.88 50.7,25.88 50.7,25.83 50.34,25.48 50.34,25.65 50.52,25.83 50.24,25.83 50.16,25.76 50.62,25.76 50.75,25.88
  Bottom 0.203: v50.32,25.76 43.94,19.38 39.88,19.38 39.19,20.07 35.59,20.07 27.99,27.66 19.96,27.66 18.97,28.65 v15.88,28.65
SDIO_DAT1  (via drill 0.3)
  Top 0.203: U5.14 42.21,23.32 v42.04,23.32 | v25.65,27 27.99,29.34 29.13,29.34 30.4,30.6 J1.15 | R71.1 12.72,23.28 11.63,22.2 11.63,20.68 | 11.63,20.68 11.63,19.61 12.27,18.97 SD.8 | v11.96,20.62 11.68,20.62 11.63,20.68
  Bottom 0.203: v42.04,23.32 37.69,23.32 J1.15 | v11.96,20.62 13.23,20.62 19,26.39 25.04,26.39 v25.65,27
SDIO_DAT2  (via drill 0.3)
  Top 0.203: U5.13 43.8,22.75 42.57,23.98 v41.2,23.98 | v26.59,27 28.47,28.88 31.24,28.88 32.95,30.59 J1.14 | R72.1 4.34,23.35 6.07,21.61 6.07,17.5 v12.27,11.3 14.03,11.3 SD.1
  Bottom 0.203: v12.27,11.3 12.27,18.95 19.2,25.88 25.48,25.88 v26.59,27 | v41.2,23.98 37.69,23.98 32.95,28.72 J1.14
SPI0_MISO  (via drill 0.3)
  Top 0.203: U5.27 41.92,16.5 41.68,16.26 41.68,15.62 v41.83,15.47 | U1.2 28.72,23.16 v25.25,19.68 21.26,15.7 v17.73,15.7
  Bottom 0.203: J4.20 17.73,15.52 v17.73,15.7 | v25.25,19.68 25.25,19.66 28.85,16.05 41.25,16.05 v41.83,15.47
SPI0_MOSI  (via drill 0.3)
  Top 0.203: U1.3 26.72,23.29 25.96,22.53 25.09,22.53 v23.6,21.03 v19.89,17.32 | U5.30 43.8,14.77 43.1,14.07 43.1,13.69 v42.82,13.41
  Bottom 0.203: J4.16 27.89,9.27 19.89,17.27 v19.89,17.32 | v23.6,21.03 23.6,20.3 28.27,15.62 40.59,15.62 41.45,14.76 42.9,14.76 43.1,14.55 43.1,13.69 v42.82,13.41
SPI0_SCK  (via drill 0.3)
  Top 0.203: v18.77,17.37 v22.63,21.23 24.72,23.33 U1.4 | U5.29 43.4,15.13 v42.39,14.12
  Bottom 0.203: v18.77,17.37 25.35,10.79 J4.17 | v22.63,21.23 22.63,20.62 28.07,15.19 40.31,15.19 41.38,14.12 v42.39,14.12
SPI0_SS  (via drill 0.3)
  Top 0.203: R12.1 42.23,12.07 41.71,12.6 41.71,13.31 | v17.75,17.4 v21.69,21.34 22.72,22.37 U1.5 | U5.28 42.56,15.26 41.71,14.4 41.71,13.31 | v41.85,13.34 41.73,13.34 41.71,13.31
  Bottom 0.203: v21.69,21.34 21.69,20.85 27.79,14.76 39.98,14.76 41.4,13.34 v41.85,13.34 | J4.19 20.27,14.88 v17.75,17.4
SPI_!CS1!/SDIO_DAT3  (via drill 0.3)
  Top 0.203: U5.12 44.2,22.96 42.47,24.69 39.65,24.69 38.76,25.58 38.76,28.09 | v27.51,27 28.85,28.35 38.48,28.35 38.51,28.35 | 38.53,28.35 38.73,28.35 38.76,28.37 | 38.76,28.09 38.76,28.37 | 38.76,28.37 38.76,28.57 | 38.76,28.57 38.76,29.87 J1.12 | R67.1 5.82,23.13 6.63,22.33 6.63,17.7 11.94,12.39 v12.95,12.39 14.03,12.39 SD.2 | 38.51,28.35 38.53,28.35 | 38.53,28.35 38.76,28.57 | 38.51,28.35 38.76,28.09
  Bottom 0.203: v12.95,12.39 12.95,18.95 19.38,25.38 25.88,25.38 v27.51,27
SPI_CIPO1/SDIO_DAT0  (via drill 0.3)
  Top 0.203: J1.16 27.87,30.13 v24.74,27 | R70.1 11.27,23.28 10.72,22.73 10.72,21.39 | 10.72,21.39 10.72,18.92 11.79,17.86 14.02,17.86 SD.7 | v10.9,21.31 10.79,21.31 10.72,21.39 | v41.78,22.2 41.78,22.07 U5.15
  Bottom 0.203: J1.16 36.6,21.87 40.97,21.87 41.3,22.2 v41.78,22.2 | v10.9,21.31 13.21,21.31 18.9,27 v24.74,27
SPI_COPI1/SDIO_CMD  (via drill 0.3)
  Top 0.203: U5.18 40.57,20.1 v40.49,20.02 | v17.7,27.61 J1.20 | R68.1 7.21,22.68 | 7.21,22.68 7.21,18.01 11.76,13.46 14.02,13.46 SD.3 | v7.34,22.63 7.26,22.63 7.21,22.68
  Bottom 0.203: v40.49,20.02 39.93,20.57 35.84,20.57 28.3,28.12 20.19,28.12 J1.20 | v7.34,22.63 12.72,22.63 v17.7,27.61
SPI_SCK1/SDIO_CLK  (via drill 0.3)
  Top 0.203: U5.17 41.07,20.5 v40.79,20.78 | J1.19 18.67,29.02 v18.67,27.61 | R69.1 9.82,22.07 | 9.82,22.07 9.82,18.35 12.5,15.67 SD.5 | v9.93,21.97 v9.92,21.97 9.82,22.07
  Bottom 0.203: v40.79,20.78 40.56,21.01 36.12,21.01 28.55,28.57 22.27,28.57 J1.19 | v9.93,21.97 13.03,21.97 v18.67,27.61
SWDCK
  Top 0.203: J11.3 40.34,8.68 40.34,17.27 40.76,17.7 U5.24
SWDIO
  Top 0.203: U5.25 41.05,17.3 40.77,17.02 40.77,6.57 J11.4
USB_F_N
  Top 0.203: U5.46 52.81,17.3 R29.1
USB_F_P
  Top 0.203: U5.47 52.78,17.7 R28.1
USB_N
  Top 0.254: R29.2 55.57,16.71 59.17,20.32 J10.B7 66.57,20.32 66.78,20.52 66.78,21.01 66.46,21.32 J10.A7
USB_P
  Top 0.203: 64.44,21.13 64.14,20.83 64.72,20.83 64.72,20.88 64.47,21.13
  Top 0.254: J10.A6 64.47,20.82 | 64.47,20.82 58.92,20.82 56.39,18.29 R28.2 | R28.2 | J10.B6 64.64,21.82 64.47,21.64 64.47,21.13 64.47,20.82
V_USB  (via drill 0.3)
  Top 0.203: v64.47,23.52
  Top 0.61: J10.VBUS2 v64.47,23.52 63.57,23.52 C6.2 | J10.VBUS1 v64.47,18.62 | v64.47,18.62 64.14,18.62 63.37,17.86 R23.1 62.17,17.82 IC2.4 63.66,14.76 CHG.+ 63.66,11.65 D1.+ | v64.47,18.62
  Top 0.813: D1.+ 63.94,10.22 v63.93,10.21 v63.92,10.2 Q3.1
  Bottom 0.61: v64.47,18.62 v64.47,23.52
  Bottom 0.813: J4.1 63.93,4.04 63.93,8.36 v63.93,10.21
  pour Top: 64.54,8.94 63.14,8.94 63.14,14.48 63.14,14.53 61.72,15.95 61.72,18.34 63.4,18.34 63.88,18.82 65.99,18.82 65.99,18.41 64.49,18.41 63.32,17.25 63.32,15.88 64.11,15.09 64.26,14.94 64.26,12.52 64.74,12.04 64.74,8.94
VBAT  (via drill 0.3)
  Top 0.203: Q3.3 62.98,6.43 | 62.98,6.43 R13.2 60.55,5.87 D5.+ | J6.1 62.98,6.43
  Top 0.61: IC2.3 62.18,13.64 v62.18,12.52
  Top 0.813: v60.35,7.32 v60.35,7.31 D5.+
  Bottom 0.813: v62.18,12.52 60.35,10.69 v60.35,7.32
  pour Top: 66.73,7.26 64.47,7.26 63.75,7.98 59.66,7.98 59.66,5.36 66.7,5.36 66.73,5.36
VSYS  (via drill 0.3)
  Top 0.61: U8.1 58.58,11.33 | 58.58,11.33 58.58,12.86 R5.1 | 58.58,11.33 58.62,11.37 D1.- 60.35,11.08 D5.-
  Top 0.813: C2.2 R5.1 | D5.- 62,9.36 Q3.2 61.92,9.49 v61.92,10.19
  Bottom 0.813: 62.61,2.83 J4.2 61.92,3.51 v61.92,10.19
  pour Top: 58.01,15.11 58.01,12.06 58.34,11.73 58.34,10.31 59.21,10.31 59.69,9.83 59.69,8.64 62.41,8.64 62.41,10.13 61.44,11.1 61.44,12.14 59.64,12.14 59.11,12.67 59.11,15.09 59.11,15.11

### Text on the board
tPlace: - | +
bPlace: GND | GND | GP9 | GP8 | GP7 | GP6 | GND | GP5 | GP4 | GP3 | GP2 | GND | GP1 | GP0 | GP15 | GP14 | GP13 | GP12 | GP11 | GP10 | 3V3 | RFM98W 433MHz | GND | RFM95W 868MHz | DCK | RFM95W 915MHz | DIO | MaPIE LoRa Radio v2.1 | www.makerfabs.com | - | + | GP22 | RUN | GP26 | GP27 | GND | GP28 | ADC_VREF | 3V3(OUT) | 3V3_EN | GND | GP16 | GP17 | GND | GP18 | GP19 | GP20 | GP21 | GND | VSYS | VBUS
tNames: J1